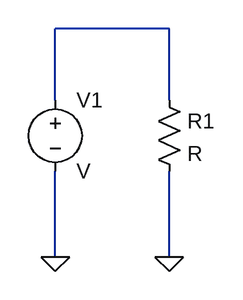
[diagram p0: schematic test.asc]
test.asc, the LTspice schematic file:
Version 4
SHEET 1 880 680
WIRE 208 0 80 0
WIRE 80 80 80 0
WIRE 208 80 208 0
WIRE 80 256 80 160
WIRE 208 256 208 160
FLAG 80 256 0
FLAG 208 256 0
SYMBOL res 192 64 R0
SYMATTR InstName R1
SYMBOL voltage 80 64 R0
SYMATTR InstName V1

The netlist it stands for:
* test.asc
R1 N001 0 R
V1 N001 0 V
.backanno
.end